# EAGLE design Mutteruhr (EAGLE 6.1)
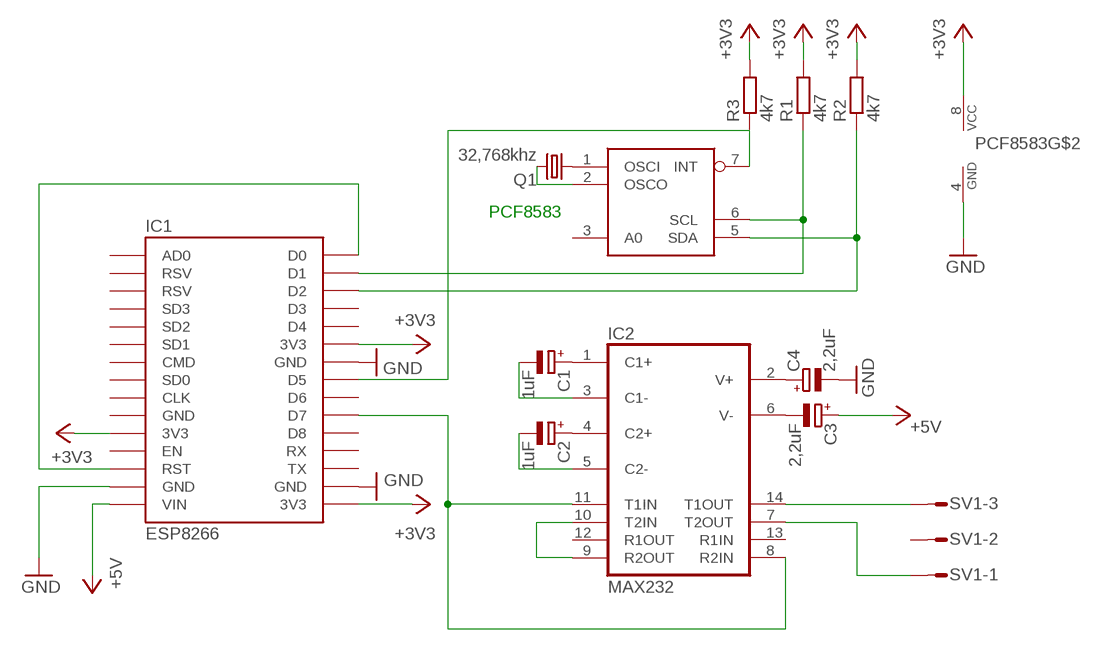
[diagram p0: schematic, sheet 1]

## Parts
C1  1uF  CPOL-EUE2.5-5  [E2,5-5]
C2  1uF  CPOL-EUE2.5-5  [E2,5-5]
C3  2,2uF  CPOL-EUE2.5-5  [E2,5-5]
C4  2,2uF  CPOL-EUE2.5-5  [E2,5-5]
IC1  ESP8266  ESP12E_DEVKIT  [ESP12E_DEVKIT]
IC2  MAX232  [DIL16]
PCF8583  PCF8583P  [DIL08]
Q1  32,768khz  CRYSTALTC38H  [TC38H]
R1  4k7  R-EU_0207/10  [0207/10]
R2  4k7  R-EU_0207/10  [0207/10]
R3  4k7  R-EU_0207/10  [0207/10]
SV1  MT6-3  [MT6-3]

## Nets
+3V3: IC1.3V3@0(3V3) IC1.3V3@1(3V3) IC1.3V3@2(3V3) PCF8583.8(VCC) R1.2 R2.2 R3.2
+5V: C3.+ IC1.VIN
CLOCK_1: IC2.14(T1OUT) SV1.3
CLOCL_2: IC2.7(T2OUT) SV1.1
GND: C4.- IC1.GND@1(GND) IC1.GND@2(GND) IC1.GND@3(GND) PCF8583.4(GND)
INTERRUPT: IC1.D5 PCF8583.7(INT) R3.1
MAX_OUT: IC1.D7 IC2.8(R2IN) IC2.11(T1IN)
N$1: PCF8583.1(OSCI) Q1.1
N$2: PCF8583.2(OSCO) Q1.2
N$3: C2.- IC2.5(C2-)
N$4: C1.- IC2.3(C1-)
N$5: C1.+ IC2.1(C1+)
N$6: C2.+ IC2.4(C2+)
N$7: C3.- IC2.6(V-)
N$8: C4.+ IC2.2(V+)
N$9: IC2.9(R2OUT) IC2.10(T2IN)
RESET: IC1.D0 IC1.RST
SCL: IC1.D1 PCF8583.6(SCL) R1.1
SDA: IC1.D2 PCF8583.5(SDA) R2.1
Unconnected: IC1.AD0 IC1.CLK IC1.CMD IC1.D3 IC1.D4 IC1.D6 IC1.D8 IC1.EN IC1.GND@0(GND) IC1.RSV@0(RSV) IC1.RSV@1(RSV) IC1.RX IC1.SD0 IC1.SD1 IC1.SD2 IC1.SD3 IC1.TX IC2.12(R1OUT) IC2.13(R1IN) PCF8583.3(A0) SV1.2

## Notes on the sheet
- PCF8583

## Power pins joined to a net without a drawn wire
GND: IC2.15(GND)
VCC: IC2.16(VCC)

## Library data of the parts
C1-C4 = rcl:CPOL-EU: POLARIZED CAPACITOR, European symbol
IC1 = ESP12E_DEVKIT:ESP12E_DEVKIT: ESP12E DEVKIT BOARD
IC2 = maxim:MAX232: RS232 TRANSEIVER; MF: MAXIM; MPN: MAX232ACPE+; OC_FARNELL: 9723773; OC_NEWARK: 68K4544
PCF8583 = i2c:PCF8583: Clock/calendar with 240 x 8-bit RAM
Q1 = crystal:CRYSTAL: CRYSTAL; OC_FARNELL: unknown; OC_NEWARK: unknown
R1-R3 = resistor:R-EU_: RESISTOR, European symbol
SV1 = con-amp-mt6:MT6-3: AMP MT6 CONNECTOR; OC_FARNELL: unknown; OC_NEWARK: unknown

## Board
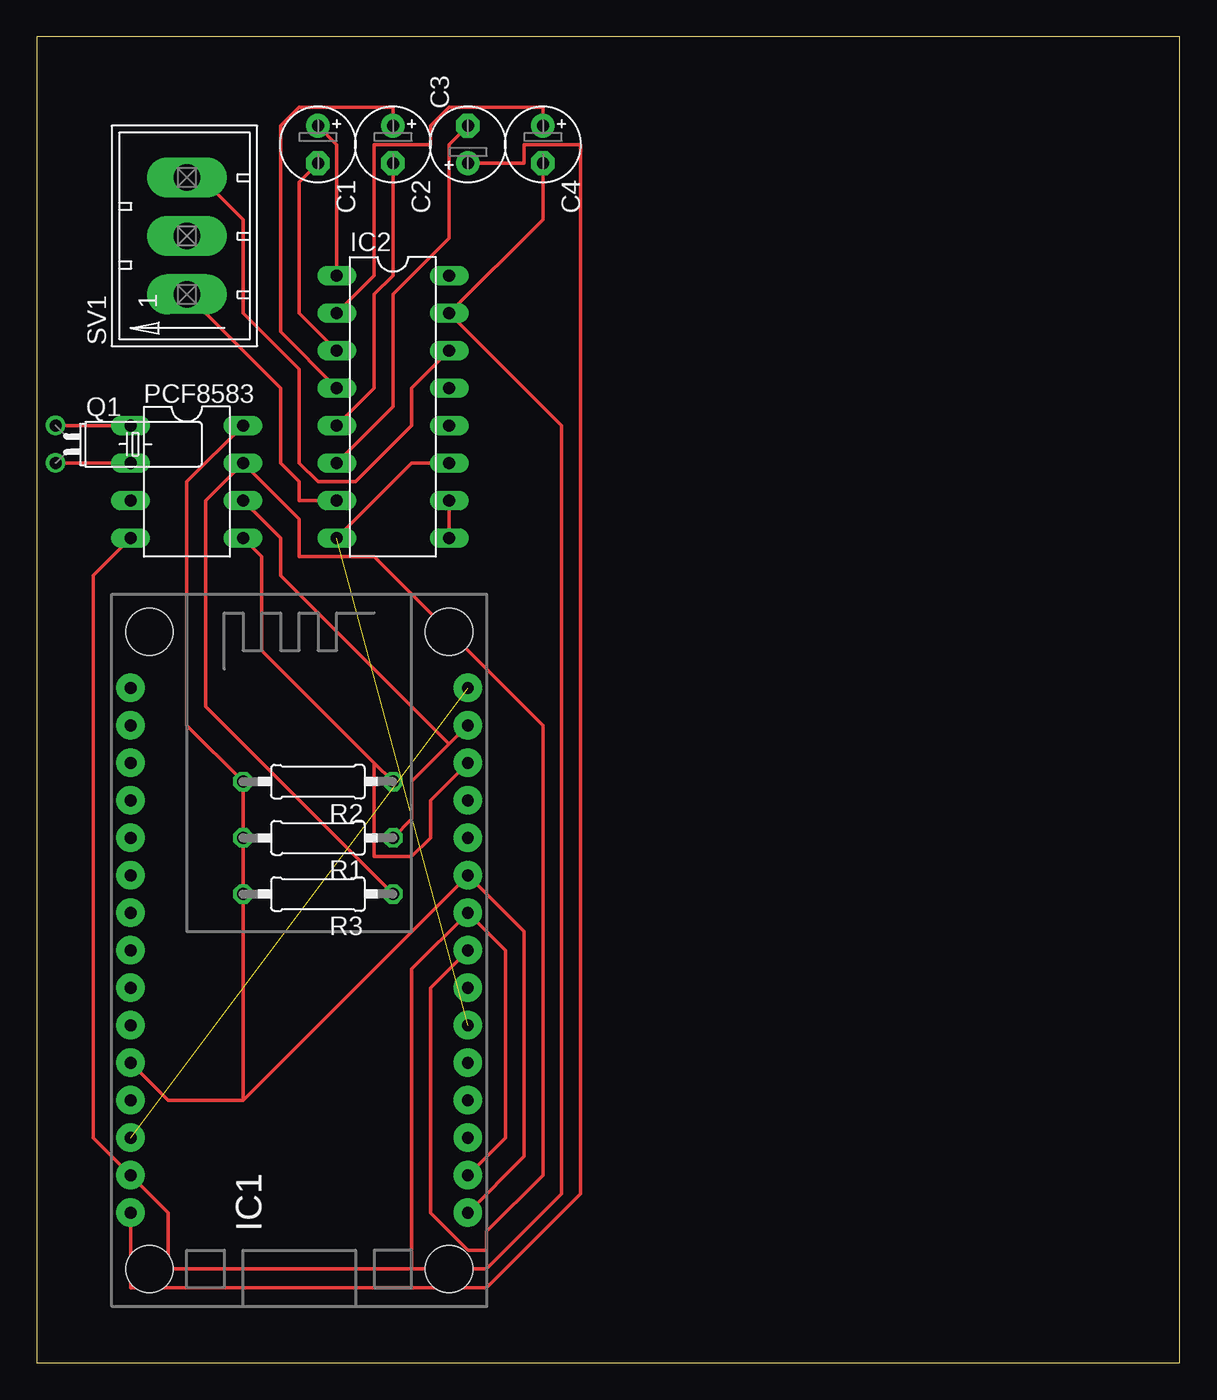
[diagram p1: board, top side]

Size 77.45 x 89.84 mm. Coordinates in mm from the lower left corner, seen from the top.
Outline: 0,0 77.45,0 77.45,89.84 0,89.84 0,0
Copper layers (1*16): Top 0.035mm / dielectric 1.5mm / Bottom 0.035mm
Design rules: minimum track width 10mil, minimum drill 24mil, track to track 8mil, track to pad 8mil, pad to pad 8mil, via to via 8mil, smd to smd 8mil, copper to edge 40mil, drill to drill 8mil, minimum pad ring 10mil, minimum via ring 8mil, stop-mask expansion 4mil, vias tented up to drill 0mil, thermal gap 10mil

### Footprints (pad centres in the part's own frame; a part is rotated, then mirrored left to right if it is on the bottom)
E2,5-5 = drill 0.813 pad 1.6: + -1.27,0 | drill 0.813 pad 1.6 octagon: - 1.27,0
ESP12E_DEVKIT = drill 0.8 pad 1.93: 3V3@0 -11.43,-7.62; 3V3@1 11.43,5.08; 3V3@2 11.43,-17.78; AD0 -11.43,17.78; CLK -11.43,-2.54; CMD -11.43,2.54; D0 11.43,17.78; D1 11.43,15.24; D2 11.43,12.7; D3 11.43,10.16; D4 11.43,7.62; D5 11.43,0; D6 11.43,-2.54; D7 11.43,-5.08; D8 11.43,-7.62; EN -11.43,-10.16; GND@0 -11.43,-5.08; GND@1 -11.43,-15.24; GND@2 11.43,2.54; GND@3 11.43,-15.24; RST -11.43,-12.7; RSV@0 -11.43,15.24; RSV@1 -11.43,12.7; RX 11.43,-10.16; SD0 -11.43,0; SD1 -11.43,5.08; SD2 -11.43,7.62; SD3 -11.43,10.16; TX 11.43,-12.7; VIN -11.43,-17.78 | hole 3.2: -10.16,21.59; 10.16,21.59; 10.16,-21.59; -10.16,-21.59
DIL16 = drill 0.813 long: 1 -8.89,-3.81; 2 -6.35,-3.81; 3 -3.81,-3.81; 4 -1.27,-3.81; 5 1.27,-3.81; 6 3.81,-3.81; 7 6.35,-3.81; 8 8.89,-3.81; 9 8.89,3.81; 10 6.35,3.81; 11 3.81,3.81; 12 1.27,3.81; 13 -1.27,3.81; 14 -3.81,3.81; 15 -6.35,3.81; 16 -8.89,3.81
DIL08 = drill 0.813 long: 1 -3.81,-3.81; 2 -1.27,-3.81; 3 1.27,-3.81; 4 3.81,-3.81; 5 3.81,3.81; 6 1.27,3.81; 7 -1.27,3.81; 8 -3.81,3.81
TC38H = drill 0.813: 1 -1.27,0; 2 1.27,0
0207/10 = drill 0.813 octagon: 1 -5.08,0; 2 5.08,0
MT6-3 = drill 1.803 long: 1 2.54,0; 2 6.502,0; 3 10.465,0

### Placement (x,y rotation side)
C1  19.05,82.55 270 top
C2  24.13,82.55 270 top
C3  1uF  [E2,5-5]  29.21,82.55 90 top
C4  1uF  [E2,5-5]  34.29,82.55 270 top
IC1  17.78,27.94 0 top
IC2  24.13,64.77 270 top
PCF8583  10.16,59.69 270 top
Q1  1.27,62.23 270 top
R1  19.05,35.56 180 top
R2  19.05,39.37 180 top
R3  19.05,31.75 180 top
SV1  10.16,69.85 90 top

### Tracks (layer width: path | path; a pad name or v marks a point on that pad's centre or on a via)
+3V3
  Top 0.254: IC1.3V3@2 33.02,13.97 33.02,29.21 IC1.3V3@1 13.97,17.78 | PCF8583.8 10.16,59.69 10.16,43.18 R2.2 R1.2 R3.2 13.97,17.78 | IC1.3V3@0 8.89,17.78 13.97,17.78
+5V
  Top 0.254: C3.+ 33.02,81.28 33.02,82.55 36.83,82.55 36.83,11.43 30.48,5.08 6.35,5.08 IC1.VIN
CLOCK_1
  Top 0.254: IC2.14 25.4,66.04 25.4,63.5 21.59,59.69 19.05,59.69 17.78,60.96 17.78,67.31 13.97,71.12 13.97,77.47 10.16,81.28 SV1.3
CLOCL_2
  Top 0.254: IC2.7 17.78,58.42 17.78,59.69 16.51,60.96 16.51,66.04 SV1.1
GND
  Top 0.254: IC1.GND@3 31.75,15.24 31.75,27.94 IC1.GND@2 25.4,26.67 25.4,6.35 | C4.- 34.29,77.47 IC2.15 35.56,63.5 35.56,11.43 30.48,6.35 25.4,6.35 | PCF8583.4 3.81,53.34 3.81,15.24 IC1.GND@1 8.89,10.16 8.89,6.35 25.4,6.35
INTERRUPT
  Top 0.254: R3.1 11.43,44.45 11.43,58.42 PCF8583.7 17.78,57.15 17.78,54.61 22.86,54.61 34.29,43.18 34.29,12.7 30.48,8.89 30.48,7.62 29.21,7.62 26.67,10.16 26.67,25.4 IC1.D5
MAX_OUT  (1 unrouted)
  Top 0.254: IC2.8 25.4,60.96 IC2.11
N$1
  Top 0.254: PCF8583.1 Q1.1
N$2
  Top 0.254: PCF8583.2 Q1.2
N$3
  Top 0.254: IC2.5 22.86,66.04 22.86,72.39 24.13,73.66 C2.-
N$4
  Top 0.254: IC2.3 17.78,71.12 17.78,80.01 C1.-
N$5
  Top 0.254: IC2.1 20.32,82.55 C1.+
N$6
  Top 0.254: IC2.4 16.51,69.85 16.51,83.82 17.78,85.09 24.13,85.09 C2.+
N$7
  Top 0.254: IC2.6 24.13,64.77 24.13,72.39 27.94,76.2 27.94,82.55 C3.-
N$8
  Top 0.254: IC2.2 22.86,73.66 22.86,82.55 26.67,82.55 26.67,83.82 27.94,85.09 34.29,85.09 C4.+
N$9
  Top 0.254: IC2.10 IC2.9
RESET  (1 unrouted)
SCL
  Top 0.254: R1.1 25.4,36.83 25.4,39.37 27.94,41.91 | IC1.D1 27.94,41.91 | PCF8583.6 16.51,55.88 16.51,53.34 27.94,41.91
SDA
  Top 0.254: PCF8583.5 15.24,54.61 15.24,48.26 22.86,40.64 | R2.1 22.86,40.64 | IC1.D2 26.67,38.1 26.67,35.56 25.4,34.29 22.86,34.29 22.86,40.64